# Altium project ELEC-DEM-555Timer.PrjPcb
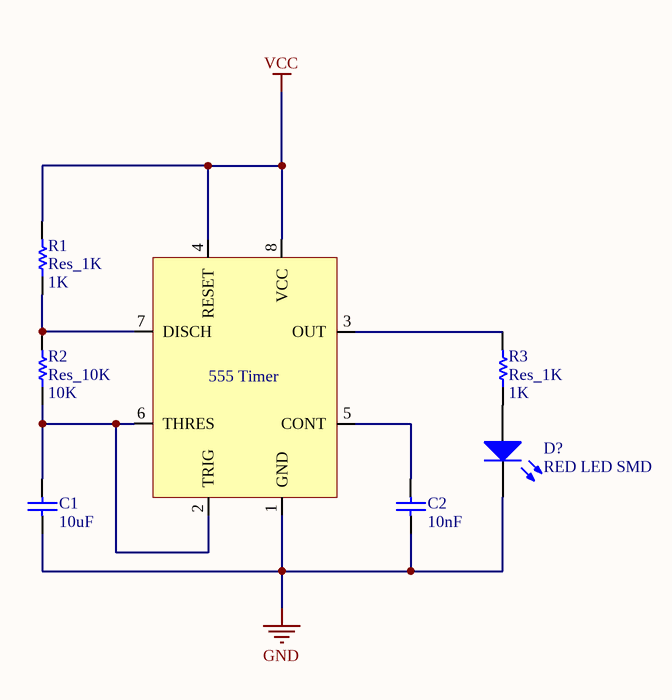
[diagram p0: ELEC-DEM-555Timer.SchDoc]
1 sheet, 7 parts. Net scope: global (net labels, ports and power ports of the same name join across sheets).

## Sheet ELEC-DEM-555Timer.SchDoc
size A4

### Parts
*  555 Timer
C1  10uF  [C1206]
C2  10nF  [C1206]
D?  RED LED SMD  [LED-1]
R1  Res_1K  value 1K  [AXIAL-0.5]
R2  Res_10K  value 10K  [AXIAL-0.5]
R3  Res_1K  value 1K  [AXIAL-0.5]

### Nets
GND: *.1(GND) C1.1 C2.1 D?.2(K)
VCC: *.4(RESET) *.8(VCC) R1.2
Net*_2: *.2(TRIG) *.6(THRES) C1.2 R2.1
Net*_3: *.3(OUT) R3.2
Net*_5: *.5(CONT) C2.2
Net*_7: *.7(DISCH) R1.1 R2.2
NetD?_1: D?.1(A) R3.1

### Library data of the parts
C1 = Cap_10uF: Capacitor (Semiconductor SIM Model); Published: 8-Jun-2000; LatestRevisionDate: 29-May-2009; LatestRevisionNote: IPC-7351 Footprint Added.; PackageReference: C1206; Publisher: Altium Limited; PackageDescription: Chip Capacitor; Supplier 1: Digi-Key; Supplier Part Number 1: 478-1653-1-ND
C2 = Cap_10nF: Capacitor (Semiconductor SIM Model); Published: 8-Jun-2000; LatestRevisionDate: 29-May-2009; LatestRevisionNote: IPC-7351 Footprint Added.; PackageReference: C1206; Publisher: Altium Limited; PackageDescription: Chip Capacitor; Supplier 1: Digi-Key
D? = RED LED SMD: RED LED; Published: 8-Jun-2000; LatestRevisionDate: 08-Jul-2005; LatestRevisionNote: Mech Layer 1 removed.; PackageReference: LED-1; Publisher: Altium Limited; PackageDescription: LED; 2 Leads; Supplier 1: Digi-Key; Supplier Part Number 1: 846-1197-6-ND
R1 R3 = Res_1K: 1K Resistor; Published: 8-Jun-2000; LatestRevisionDate: 17-Jul-2002; LatestRevisionNote: Re-released for DXP Platform.; PackageReference: AXIAL-0.5; Publisher: Altium Limited; PackageDescription: Axial Device, Thru-Hole; 2 Leads; 0.5 in Pin Spacing; Supplier 1: Digi-Key
R2 = Res_10K: 10K Resistor; Published: 8-Jun-2000; LatestRevisionDate: 17-Jul-2002; LatestRevisionNote: Re-released for DXP Platform.; PackageReference: AXIAL-0.5; Publisher: Altium Limited; PackageDescription: Axial Device, Thru-Hole; 2 Leads; 0.5 in Pin Spacing; Supplier 1: Digi-Key
* = 555 Timer: Supplier 1: Digi-Key